# EAGLE board arm_board (EAGLE 8.1.0)
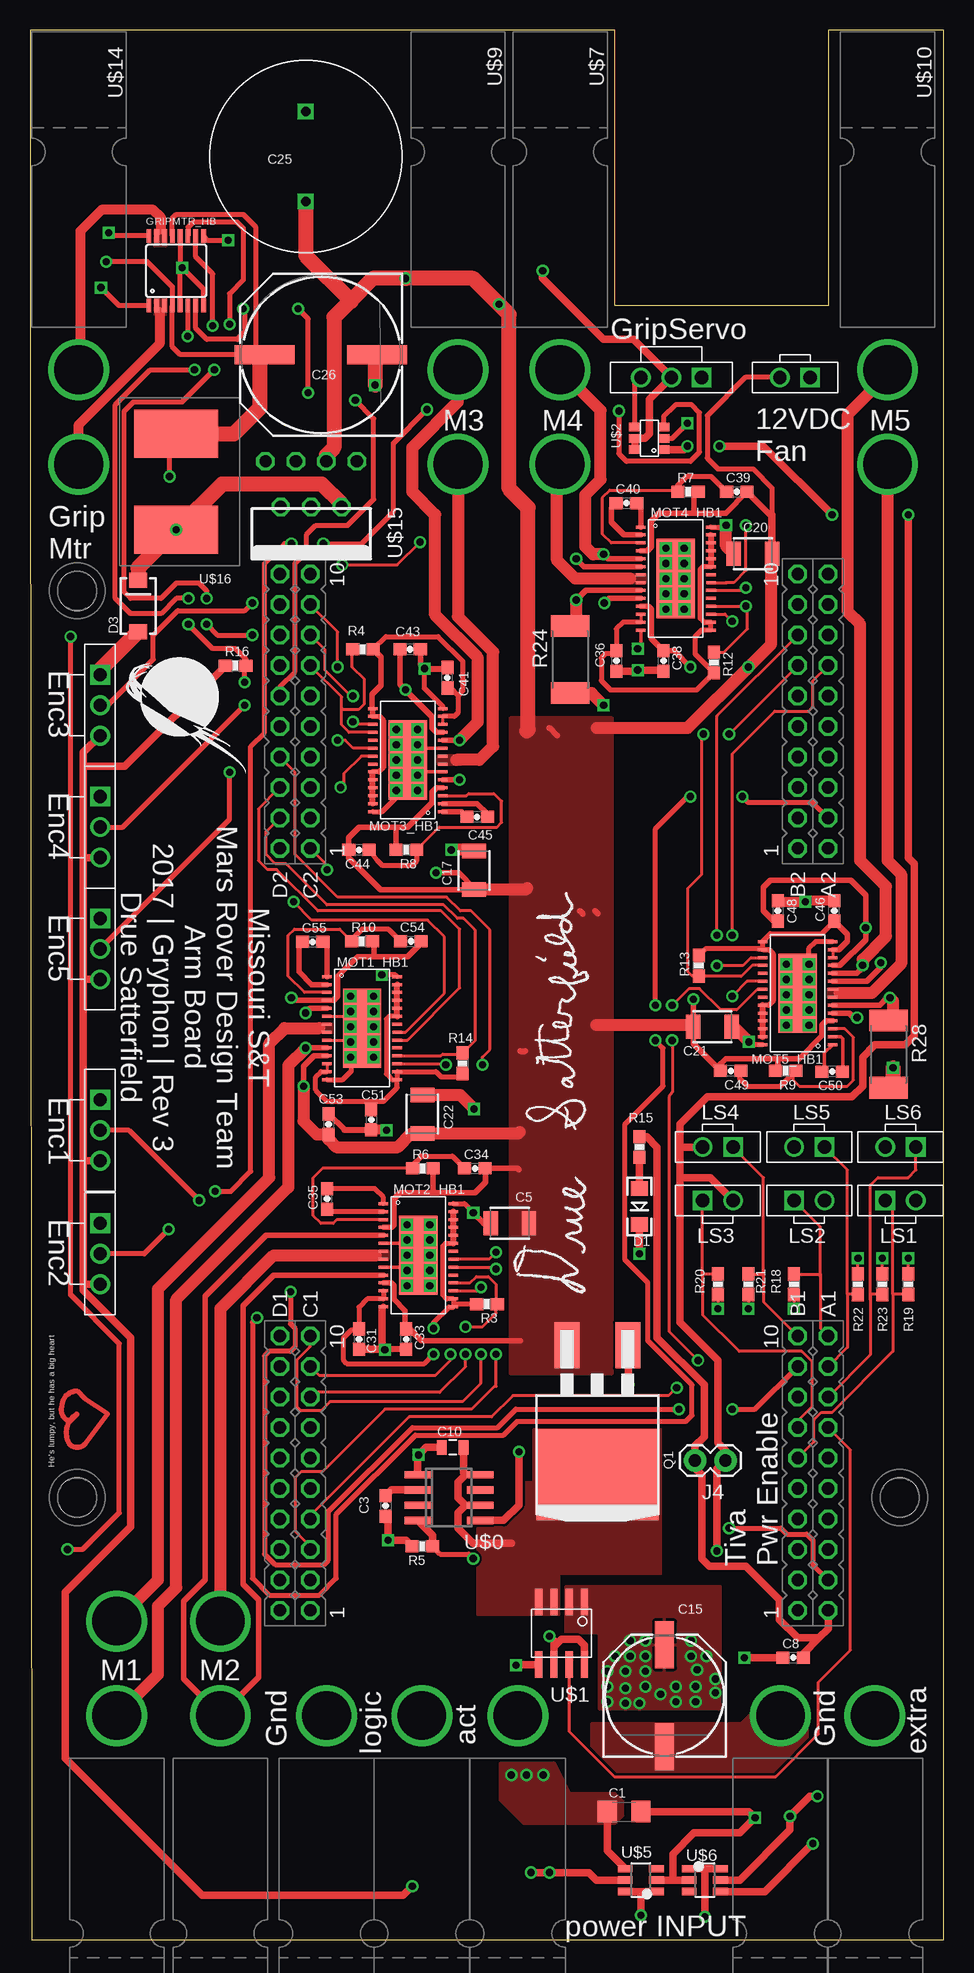
[diagram p4: board, top side]
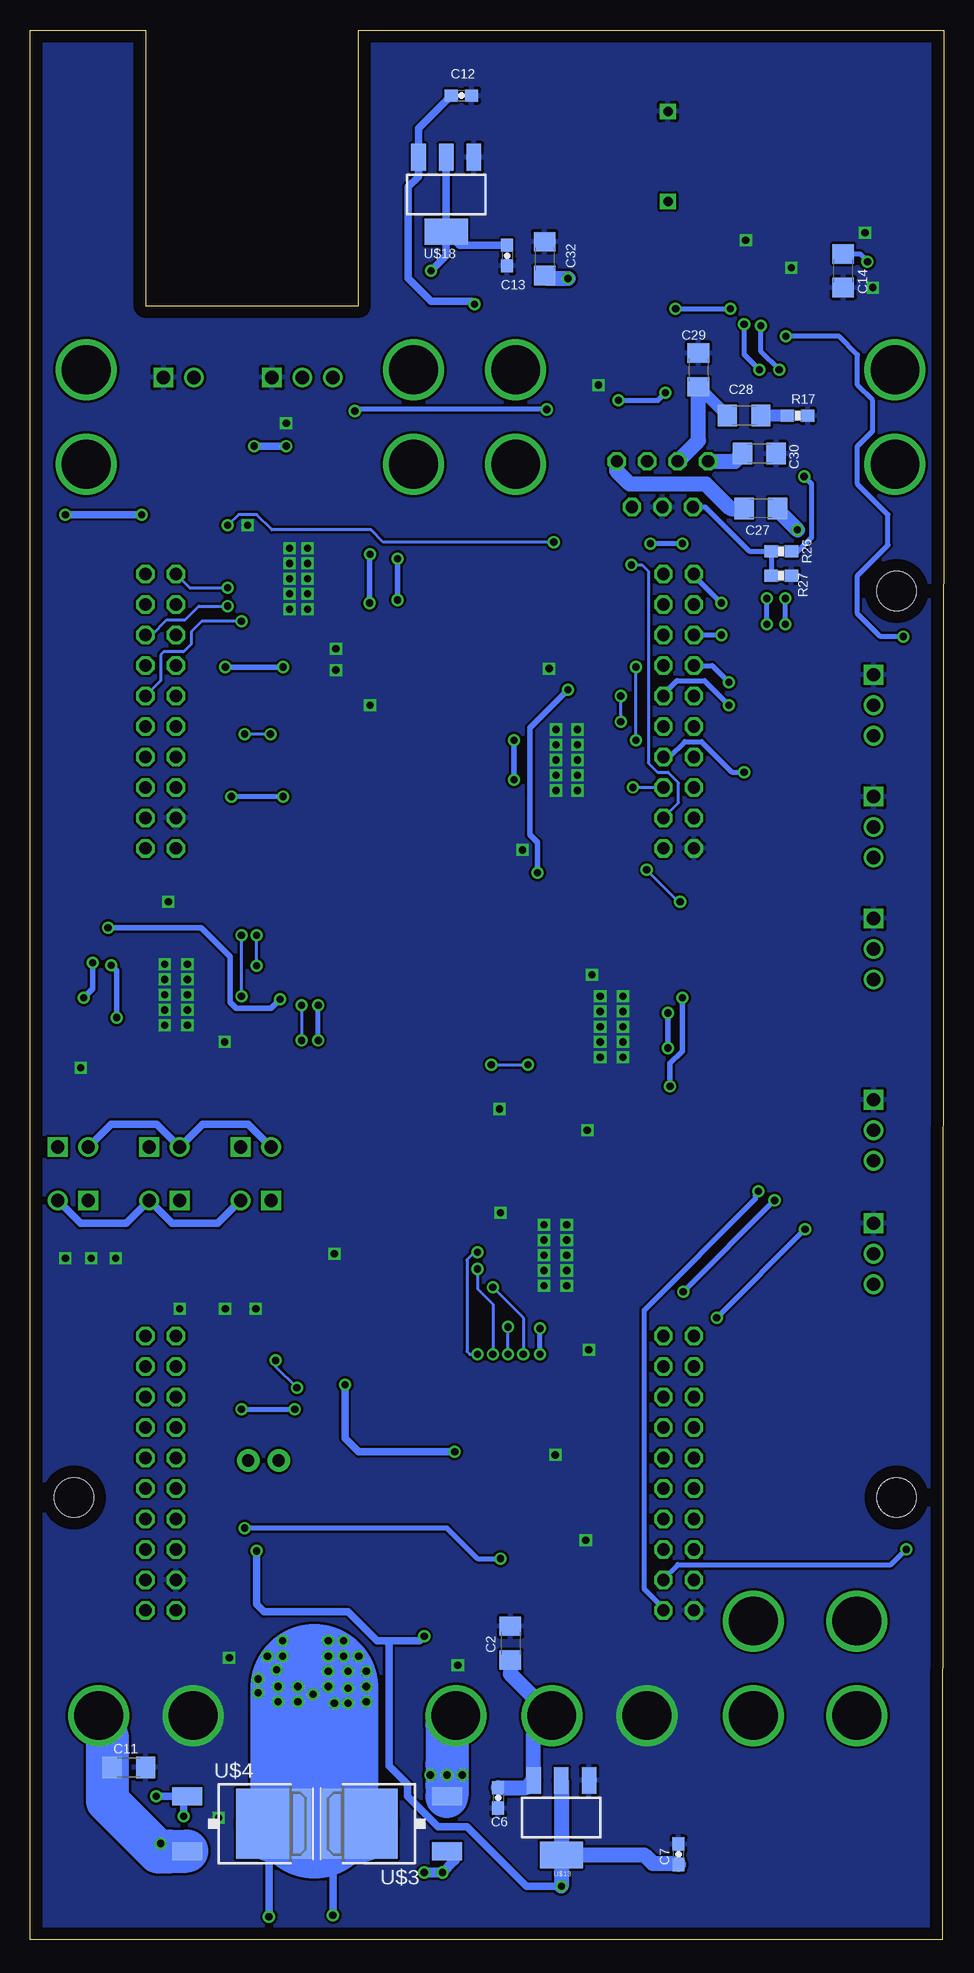
[diagram p5: board, bottom side, seen from below]

Size 76.18 x 159.13 mm. Coordinates in mm from the lower left corner, seen from the top.
Outline: 0.13,0 76.18,0 76.18,159.13 66.55,159.13 66.55,136.14 48.77,136.14 48.77,159.13 0,159.13 0,135.56 0.13,0
Copper layers (1*16): Top 0.035mm / dielectric 1.5mm / Bottom 0.035mm
Design rules "advanced_circuits_standard *": minimum track width 5mil, minimum drill 10mil, track to track 8mil, track to pad 8mil, pad to pad 8mil, via to via 8mil, smd to smd 8mil, copper to edge 40mil, drill to drill 5mil, minimum pad ring 10mil, minimum via ring 8mil, stop-mask expansion 4mil, vias tented up to drill 0mil, thermal gap 10mil

## Footprints (pad centres in the part's own frame; a part is rotated, then mirrored left to right if it is on the bottom)
1206 = smd 1.6 x 1.8: 1 -1.4,0; 2 1.4,0
0603-CAP = smd 1.1 x 1: 1 -0.85,0; 2 0.85,0
1210 = smd 1.2 x 2: 1 -1.6,0; 2 1.6,0
0805 = smd 0.8 x 1.2: 1 -0.9,0; 2 0.9,0
PANASONIC_G = smd 3.9 x 1.6: + 4.25,0; - -4.25,0
C_16MM = drill 0.8 square: + 0,3.75; GND 0,-3.75
PANASONIC_H13 = smd 5 x 1.6: + 4.7,0; - -4.7,0
LED-1206 = smd 1.2 x 1.4: A -1.5,0; C 1.5,0
SMA-DIODE = smd 1.27 x 1.47: A -2.15,0; C 2.15,0
TSSOP-16 = smd 0.4 x 1.1: 1 -2.275,-2.9; 2 -1.625,-2.9; 3 -0.975,-2.9; 4 -0.325,-2.9; 5 0.325,-2.9; 6 0.975,-2.9; 7 1.625,-2.9; 8 2.275,-2.9; 9 2.275,2.9; 10 1.625,2.9; 11 0.975,2.9; 12 0.325,2.9; 13 -0.325,2.9; 14 -0.975,2.9; 15 -1.625,2.9; 16 -2.275,2.9
#4_SCREW = hole 3.264: 0,0
APP45_PCB_HORIZ_RIGHT = drill 4.064: P$1 28.194,3.969
1X02 = drill 1.016 pad 1.88: 1 0,0; 2 2.54,0
MOLEX-70543-0002 = drill 1.1 square: 1 2.54,0 | drill 1.1: 2 0,0; 3 -2.54,0
MOLEX-70543-0001 = drill 1.1 square: 1 1.27,0 | drill 1.1: 2 -1.27,0
TSSOP28-GROUNDPAD = smd 0.8 x 0.25: 1 -2.921,4.298; 2 -2.921,3.637; 3 -2.921,2.977; 4 -2.921,2.317; 5 -2.921,1.656; 6 -2.921,0.996; 7 -2.921,0.335; 8 -2.927,-0.325; 9 -2.921,-0.985; 10 -2.921,-1.646; 11 -2.921,-2.306; 12 -2.921,-2.967; 13 -2.921,-3.627; 14 -2.921,-4.287; 15 2.921,-4.287; 16 2.921,-3.627; 17 2.921,-2.967; 18 2.921,-2.306; 19 2.921,-1.646; 20 2.921,-0.985; 21 2.927,-0.325; 22 2.921,0.335; 23 2.921,0.996; 24 2.921,1.656; 25 2.921,2.317; 26 2.921,2.977; 27 2.921,3.637; 28 2.921,4.298 | smd 3.2 x 6.6: 29 0,0.005
D2PACK = smd 2.083 x 3.81: 1 2.54,-4.191; 2 7.62,-4.191 | smd 10.16 x 7.62: TAB 5.08,6.604
0603-RES = smd 1.1 x 1: 1 -0.85,0; 2 0.85,0
0603-RES@1 = smd 1.1 x 1: 1 -0.85,0; 2 0.85,0
R2512 = smd 1.8 x 3.2: 1 -2.8,0; 2 2.8,0
TIVA-C-CONNECTED = drill 1.016 octagon: +3V3_1 59.69,54.61; +3V3_2 123.19,54.61; +5V_1 59.69,52.07; +5V_2 123.19,52.07; GND_1 57.15,52.07; GND_2 59.69,8.89; GND_3 120.65,52.07; GND_4 123.19,8.89; PA4 39.37,52.07; PA5 36.83,52.07; PA6 105.41,52.07; PA7 52.07,8.89; PB2 102.87,54.61; PB3 100.33,54.61; PB4 54.61,52.07; PB5 52.07,52.07; PC4 118.11,54.61; PC5 115.57,54.61; PC6 113.03,54.61; PC7 105.41,54.61; PD0 107.95,8.89; PD1 110.49,8.89; PD2 57.15,54.61; PD3 107.95,54.61; PD4 49.53,54.61; PD5 46.99,54.61; PD7 107.95,52.07; PE0 118.11,52.07; PE1 115.57,52.07; PE2 113.03,52.07; PE3 110.49,52.07; PE4 120.65,54.61; PE5 110.49,54.61; PF1 123.19,11.43; PF2 120.65,11.43; PF3 118.11,11.43; PG0 115.57,11.43; PG1 59.69,11.43; PH0 44.45,11.43; PH1 41.91,11.43; PH2 118.11,8.89; PH3 115.57,8.89; PK0 49.53,52.07; PK1 46.99,52.07; PK2 44.45,52.07; PK3 41.91,52.07; PK4 57.15,11.43; PK5 54.61,11.43; PK6 39.37,11.43; PK7 36.83,11.43; PL0 107.95,11.43; PL1 105.41,11.43; PL2 102.87,11.43; PL3 100.33,11.43; PL4 113.03,11.43; PL5 110.49,11.43; PM0 52.07,11.43; PM1 49.53,11.43; PM2 46.99,11.43; PM3 120.65,8.89; PM4 102.87,52.07; PM5 100.33,52.07; PM6 36.83,8.89; PM7 57.15,8.89; PN2 105.41,8.89; PN3 102.87,8.89; PN4 36.83,54.61; PN5 39.37,54.61; PP0 54.61,54.61; PP1 52.07,54.61; PP2 100.33,8.89; PP3 41.91,8.89; PP4 41.91,54.61; PP5 54.61,8.89; PQ0 44.45,54.61; PQ1 39.37,8.89; PQ2/PA3 46.99,8.89; PQ3/PA2 44.45,8.89; RST1 49.53,8.89; RST_2 113.03,8.89
SO8 = smd 0.6 x 2.2: 1 -1.905,-2.6; 2 -0.635,-2.6; 3 0.635,-2.6; 4 1.905,-2.6; 5 1.905,2.6; 6 0.635,2.6; 7 -0.635,2.6; 8 -1.905,2.6
SOIC8 = smd 2.2 x 0.6: 1 -2.6,1.905; 2 -2.6,0.635; 3 -2.6,-0.635; 4 -2.6,-1.905; 5 2.6,-1.905; 6 2.6,-0.635; 7 2.6,0.635; 8 2.6,1.905
TSOP-6 = smd 0.991 x 0.711: 1 -1.194,0.94; 2 -1.194,0; 3 -1.194,-0.94; 4 1.194,-0.94; 5 1.194,0; 6 1.194,0.94
TO252 = smd 1.5 x 2.5: 1 -2.28,-4.8; 2 2.28,-4.8 | smd 5.8 x 6.4: 3 0,2.5
TSOT23-6 = smd 0.62 x 1.22: 1 -0.95,-1.3; 2 0,-1.3; 3 0.95,-1.3; 4 0.95,1.3; 5 0,1.3; 6 -0.95,1.3
APP45_HORIZ_CONFIG = drill 4.064: C1 28.194,3.937; C2 36.068,3.937
SOT223 = smd 1.219 x 2.235: 1 -2.311,-3.099; 2 0,-3.099; 3 2.311,-3.099 | smd 3.6 x 2.2: 4 0,3.099
TO-220-7 = drill 1.016 octagon: 1 -3.81,3.81; 2 0,2.54; 3 -3.81,1.27; 4 0,0; 5 -3.81,-1.27; 6 0,-2.54; 7 -3.81,-3.81
.5*.5_SMD = smd 4 x 7: P$1 0,1.27; P$2 8,1.27

## Placement (x,y rotation side)
C1  2.2uF  [1206]  49.53,10.67 0 top
C2  2.2uF  [1206]  36.13,24.7 270 bottom
C3  1.0uF  [0603-CAP]  29.65,36.13 270 top
C5  100uF  [1210]  40.01,59.69 0 top
C6  1.0uF  [0603-CAP]  37.15,11.81 270 bottom
C7  1uF  [0603-CAP]  22.1,7.11 90 bottom
C8  0.01uF  [0603-CAP]  63.63,23.5 0 top
C10  10uF  [0805]  35.24,41.02 180 top
C11  2.2uF  [1206]  67.94,14.35 0 bottom
C12  1.0uF  [0603-CAP]  40.21,153.67 0 bottom
C13  1uF  [0603-CAP]  36.4,140.34 270 bottom
C14  4.7uF  [1206]  8.38,139.06 90 bottom
C15  680uF  [PANASONIC_G]  52.91,20.32 90 top
C17  100uF  [1210]  37.03,89.1 270 top
C20  100uF  [1210]  60.27,115.49 0 top
C21  100uF  [1210]  56.9,76.07 180 top
C22  100uF  [1210]  32.72,68.78 270 top
C25  2200uF  [C_16MM]  22.99,148.59 180 top
C26  470uF  [PANASONIC_H13]  24.26,132.08 180 top
C27  .22uF  [1206]  15.24,119.25 180 bottom
C28  1200pF  [1206]  16.64,127 180 bottom
C29  680pF  [1206]  20.45,130.81 270 bottom
C30  4.7uF  [1206]  15.37,123.83 180 bottom
C31  .47uF  [0603-CAP]  27.43,50.04 270 top
C32  4.7uF  [1206]  33.27,140.08 270 bottom
C33  .1uF  [0603-CAP]  31.37,50.04 90 top
C34  .1uF  [0603-CAP]  37.08,64.26 0 top
C35  .01uF  [0603-CAP]  24.77,61.72 90 top
C36  .47uF  [0603-CAP]  48.9,106.55 270 top
C38  .1uF  [0603-CAP]  52.83,106.55 90 top
C39  .1uF  [0603-CAP]  58.93,120.65 0 top
C40  .01uF  [0603-CAP]  49.73,119.71 0 top
C41  .47uF  [0603-CAP]  34.8,105.16 90 top
C43  .1uF  [0603-CAP]  31.7,107.52 180 top
C44  .1uF  [0603-CAP]  27.43,90.81 180 top
C45  .01uF  [0603-CAP]  37.29,93.55 180 top
C46  .47uF  [0603-CAP]  67.06,85.72 90 top
C48  .1uF  [0603-CAP]  62.36,85.72 270 top
C49  .1uF  [0603-CAP]  58.42,72.39 180 top
C50  .01uF  [0603-CAP]  66.88,72.34 180 top
C51  .47uF  [0603-CAP]  28.45,68.33 270 top
C53  .1uF  [0603-CAP]  24.89,67.94 270 top
C54  .1uF  [0603-CAP]  31.75,83.19 0 top
C55  .01uF  [0603-CAP]  23.57,83.13 0 top
D1  Yellow  [LED-1206]  50.8,61.09 270 top
D3  DIODE-SCHOTTKY_  [SMA-DIODE]  9.02,111.12 90 top
GRIPMTR_HB  MAX14871  [TSSOP-16]  12.19,139.06 0 top
H1  MOUNTING_HOLE#4  [#4_SCREW]  3.94,112.39 0 top
H2  MOUNTING_HOLE#4  [#4_SCREW]  3.94,36.83 0 top
H4  MOUNTING_HOLE#4  [#4_SCREW]  72.52,36.83 0 top
J1  APPPP45_PCB_HORIZ_RIGHT  [APP45_PCB_HORIZ_RIGHT]  28.7,-9.53 90 top
J2  APPPP45_PCB_HORIZ_RIGHT  [APP45_PCB_HORIZ_RIGHT]  36.64,-9.53 90 top
J3  APPPP45_PCB_HORIZ_RIGHT  [APP45_PCB_HORIZ_RIGHT]  44.64,-9.53 90 top
J4  [1X02]  55.45,39.93 0 top
J5  SERVOMOLEX_SL_VERT_TH  [MOLEX-70543-0002]  53.47,130.18 0 top
J6  SL02  [MOLEX-70543-0001]  63.78,130.18 0 top
J17  APPPP45_PCB_HORIZ_RIGHT  [APP45_PCB_HORIZ_RIGHT]  66.55,-9.53 90 top
J18  APPPP45_PCB_HORIZ_RIGHT  [APP45_PCB_HORIZ_RIGHT]  74.42,-9.53 90 top
J19  ENCODER  [MOLEX-70543-0002]  5.84,67.44 90 top
J20  ENCODER  [MOLEX-70543-0002]  5.84,102.87 90 top
J21  ENCODER  [MOLEX-70543-0002]  5.84,92.71 90 top
J22  ENCODER  [MOLEX-70543-0002]  5.84,82.55 90 top
J24  ENCODER  [MOLEX-70543-0002]  5.84,57.15 90 top
LOGO1  MRDT_LOGO  [MRDT_LOGO]  7.19,106.86 270 top
LS1  SL02  [MOLEX-70543-0001]  72.59,61.59 180 top
LS2  SL02  [MOLEX-70543-0001]  64.97,61.59 180 top
LS3  SL02  [MOLEX-70543-0001]  57.35,61.59 180 top
LS4  SL02  [MOLEX-70543-0001]  57.35,66.04 0 top
LS5  SL02  [MOLEX-70543-0001]  64.97,66.04 0 top
LS6  SL02  [MOLEX-70543-0001]  72.59,66.04 0 top
MOT1_HB1  DRV8829  [TSSOP28-GROUNDPAD]  27.69,75.95 0 top
MOT2_HB1  DRV8829  [TSSOP28-GROUNDPAD]  32.39,57.02 0 top
MOT3_HB1  DRV8829  [TSSOP28-GROUNDPAD]  31.5,98.3 180 top
MOT4_HB1  DRV8829  [TSSOP28-GROUNDPAD]  53.85,113.41 0 top
MOT5_HB1  DRV8829  [TSSOP28-GROUNDPAD]  64.01,78.87 180 top
Q1  Q_IRF7437SMD  [D2PACK]  52.39,45.34 180 top
R3  10k  [0603-RES]  38.1,52.96 180 top
R4  10k  [0603-RES]  27.76,107.52 0 top
R5  10k  [0603-RES]  32.7,32.77 180 top
R6  1M  [0603-RES]  32.77,64.26 0 top
R7  1M  [0603-RES]  54.86,120.65 0 top
R8  1M  [0603-RES]  31.37,90.81 180 top
R9  1M  [0603-RES]  62.99,72.39 180 top
R10  1M  [0603-RES]  27.69,83.19 0 top
R12  10k  [0603-RES]  57.02,106.43 270 top
R13  10k  [0603-RES]  55.75,81.15 90 top
R14  10k  [0603-RES]  36.07,73.03 270 top
R15  330  [0603-RES@1]  50.8,66.04 270 top
R16  10k  [0603-RES]  17.14,106.17 0 top
R17  5100 ohm  [0603-RES]  12.19,127 180 bottom
R18  10k  [0603-RES]  63.7,54.61 270 top
R19  10k  [0603-RES]  73.23,54.61 90 top
R20  10k  [0603-RES]  57.35,54.61 270 top
R21  10k  [0603-RES]  59.89,54.61 270 top
R22  10k  [0603-RES]  69.04,54.61 90 top
R23  10k  [0603-RES]  71.07,54.61 90 top
R24  .22  [R2512]  45.03,106.68 270 top
R26  12k  [0603-RES]  13.54,115.7 180 bottom
R27  2k  [0603-RES]  13.54,113.67 0 bottom
R28  .22  [R2512]  71.58,73.79 270 top
U1  TIVA-1294  [TIVA-C-CONNECTED]  11.94,150.62 270 top
U$0  LT1910  [SO8]  34.93,36.83 270 top
U$1  ACS722LLCTR-40AU  [SOIC8]  44.32,25.53 270 top
U$2  74LVC1T45  [TSOP-6]  51.64,125.09 180 top
U$3  SUD15N15  [TO252]  46.23,9.65 90 bottom
U$4  SUD15N15  [TO252]  58.29,9.65 270 bottom
U$5  LM5050  [TSOT23-6]  50.93,4.95 90 top
U$6  LM5050  [TSOT23-6]  56.26,4.95 270 top
U$7  APP45_HORIZ  [APP45_HORIZ_CONFIG]  40.26,159 270 top
U$8  APP45_HORIZ  [APP45_HORIZ_CONFIG]  19.81,-9.53 90 top
U$9  APP45_HORIZ  [APP45_HORIZ_CONFIG]  31.75,159 270 top
U$10  APP45_HORIZ  [APP45_HORIZ_CONFIG]  67.56,159 270 top
U$11  APP45_HORIZ  [APP45_HORIZ_CONFIG]  11.18,-9.53 90 top
U$13  AZ1117EAZ1117EH-3.3  [SOT223]  31.88,10.16 180 bottom
U$14  APP45_HORIZ  [APP45_HORIZ_CONFIG]  0.13,159 270 top
U$15  SI-8010Y  [TO-220-7]  23.44,119.38 270 top
U$16  56UH  [.5*.5_SMD]  13.46,117.47 90 top
U$17  SIG  [SIG]  45.29,65.41 90 top
U$18  AZ1117EAZ1117EH-5.0  [SOT223]  41.48,145.41 180 bottom

## Tracks (layer width: path | path; a pad name or v marks a point on that pad's centre or on a via)
5VSERVO_PWR  (via drill 0.6)
  Top 0.61: U$2.6 U$2.5 51.26,125.09 51.64,125.48 51.64,128.35 J5.2 50.29,133.35 47.83,133.35 42.75,138.43 v42.75,139.06
  Bottom 0.61: U$18.2 U$18.4 | C13.1 40.35,141.19 U$18.4 | U$18.4 41.48,140.34 v42.75,139.06
7VMTR_PWR  (via drill 0.6)
  Top 0.406: GRIPMTR_HB.13 11.87,143.44 12.19,143.76 17.78,143.76 18.8,142.75 18.8,132.21 C26.+ 12.52,132.08 11.87,132.74 GRIPMTR_HB.4 11.87,137.74 9.78,139.83 v6.35,139.83 | v11.63,121.92 11.63,124.92 U$16.P$2
  Top 0.61: 19.81,132.08 C26.+
  Top 1.27: 18.92,132.08 C26.+ 19.18,131.82 19.18,127.64 17.02,125.47 13.46,125.47 | U$16.P$2 13.46,125.47 | 13.46,125.09 13.46,125.47
  Bottom 0.406: C14.2 6.99,140.47 v6.35,139.83 | R26.1 12.27,115.57 11,116.84 11,121.28 v11.63,121.92
12VMTR_PWR  (via drill 0.6)
  Top 0.406: J6.2 59.64,130.18 56.46,127 56.46,123.44 57.35,122.56 60.27,122.56 61.87,120.95 61.87,118.75 61.87,118.55
  Top 0.457: 28.7,81.92 27.31,81.92 25.65,80.26 25.65,78.61 25.3,78.26 MOT1_HB1.4 22.02,78.26 v21.79,78.49 | 28.7,81.92 31.5,81.92 32.6,83.02 | 28.7,83.02 28.7,81.92 | 24.68,67.31 C53.2 | MOT2_HB1.4 30.13,59.34 30.35,59.56 30.35,61.72 30.86,62.23 33.78,62.23 | 33.78,62.23 37.08,62.23 37.97,63.12 37.97,64.22 C34.2 40.64,64.26 40.77,64.14 | R6.2 33.62,62.4 33.78,62.23 | C33.2 31.66,50.89 32.64,49.91 40.89,49.91 | 31.28,50.89 31.28,52.41 30.35,53.34 30.35,54.48 30.12,54.72 MOT2_HB1.11 | 62.36,73.41 58,73.41 57.28,72.68 C49.2 55.32,74.64 55.32,76.1 | 62.36,73.41 64.14,73.41 66.04,75.31 66.04,76.2 66.39,76.55 MOT5_HB1.4 | 62.36,72.39 62.36,73.41 | 47.37,85.47 47.12,85.72 | MOT4_HB1.4 51.47,115.73 51.82,116.08 51.82,118.24 52.45,118.87 55.37,118.87 | 55.37,118.87 58,118.87 C39.2 61.87,118.55 | R7.2 55.37,120.31 55.37,118.87 | MOT4_HB1.11 51.58,111.11 51.82,110.87 51.82,108.42 C38.2 53.71,107.4 v55.07,106.05 | MOT3_HB1.4 33.88,95.98 33.53,95.63 33.53,94.74 31.5,92.71 30.61,92.71 | 30.61,92.71 27.43,92.71 26.54,91.82 26.54,90.84 | 26.54,90.84 C44.2 | R8.2 30.52,92.62 30.61,92.71 | 26.54,90.84 26.54,90.17 29.21,87.5 36.27,87.5 | MOT3_HB1.11 33.89,100.6 33.53,100.97 33.53,101.89 31.32,104.1 v31.32,104.14 30.85,104.61 C43.2 | MOT5_HB1.11 67.53,81.17 69.67,83.31 v69.67,84.33 69.67,87.05 68.45,88.27 61.72,88.27 61.16,87.71 61.16,85.72 62.01,84.88 C48.2 | C17.2 36.65,87.88 36.27,87.5 | 36.27,87.5 36.91,87.5 37.03,87.63 35.76,88.9 v33.86,88.9 | MOT1_HB1.11 23.68,73.64 22.81,72.77 v22.81,71.12 | C21.2 55.32,76.1 | 55.32,76.1 v55.32,78.36
  Top 0.508: 32.6,83.02 C54.2 | 46.1,85.47 45.85,85.72 | R10.2 28.7,83.02 | R9.2 62.36,72.39 | 43.94,100.33 43.31,100.97 | 40.89,74.04 41.28,74.04 | C33.2 31.28,50.89 | C48.2 62.23,85
  Top 0.61: C20.2 61.87,118.75
  Top 1.016: 41.48,87.63 41.35,87.5 C17.2 | v22.81,71.12 22.81,68.2 23.91,67.09 C53.2 24.89,66.67 25.53,66.04 30.68,66.04 31.83,67.18 C22.2 40.72,67.18 40.84,67.31 | 47.24,100.97 54.81,100.97 v59.89,106.05 61.8,107.95 61.8,115.42 C20.2 | C21.2 55.17,76.2 47.19,76.2
  Top 1.27: 41.4,100.71 41.53,100.84 41.53,119.33 39.95,120.9 39.95,135.43 v39.12,136.27 36.96,138.43 v31.32,138.43 28.58,138.43 26.67,136.53 | C25.+ 22.99,140.34 26.8,136.53 26.67,136.53 | 26.67,136.53 25.35,135.2 25.35,124.33 24.71,123.7 U$15.3
  Bottom 0.457: v31.32,104.14 34.49,100.97 34.49,92.08 33.86,91.44 v33.86,88.9 | v22.81,71.12 22.81,73.03 21.79,74.04 v21.79,78.49 | v55.07,106.05 v59.89,106.05 | v55.32,78.36 56.08,77.6 59,77.6 59.51,78.11 59.51,81.92 61.93,84.33 v69.67,84.33
  Bottom 0.61: C12.1 43.79,150.94 U$18.3 43.79,146.91 44.65,146.05 44.65,138.43 42.75,136.53 39.37,136.53 v39.12,136.27 38.94,136.45
  Bottom 1.27: C32.2 33.02,138.43 v31.32,138.43
  pour Top (no thermals): 48.51,47.12 40.08,47.12 40.08,101.85 48.51,101.85
$N3
  Top 0.61: U$0.8 36.32,38.73 | 36.32,38.73 35.69,38.1 35.69,36.83 36.32,36.2 | 36.32,36.2 U$0.6 | C10.1 36.14,38.91 36.32,38.73 | 36.32,36.2 35.69,35.56 35.69,34.29 36.96,33.02 40.13,33.02
  pour Top (rank 2, no thermals): 44.07,27.05 37.34,27.05 37.34,34.29 40.84,38.1 42.04,38.1 42.04,42.55 52.58,42.55 52.58,30.48 44.07,30.48
ACT_PWR_UNGUARDED  (via drill 0.6)
  Top 0.305: 41.43,13.97 41.4,13.94 v41.4,13.72
  Top 0.61: U$5.4 48.13,7.4 C1.1
  Bottom 0.254: 41.43,12.85 41.4,13.34
  Bottom 0.305: 41.4,13.34 v41.4,13.72 41.4,14.58 41.43,14.61
  Bottom 0.61: U$3.2 41.43,11.33 41.4,11.3
  Bottom 3.6: U$3.2 41.43,12.85 41.43,14.61 41.43,17.91 J3.P$1
  other vias: 42.8,13.72 40.13,13.72
  pour Top (no thermals): 39.24,14.73 43.69,14.73 44.96,12.19 48.77,12.19 49.4,11.56 49.4,10.29 48.77,9.65 41.15,9.65 39.24,11.56
CURRENT_INPUT
  Top 0.254: U$1.7 44.96,17.35 48.72,13.59 62.18,13.59 65.74,17.14 65.74,21.46 68.4,24.13 68.4,40.82 U1.PD3
DUAL_PWR  (via drill 0.6)
  Top 0.61: 56.26,5.9 U$6.6 | U$5.6 50.93,4 | U$5.1 50.93,4 | 50.93,4 v50.93,2.03 | U$6.1 56.26,5.9 | 56.26,5.9 v56.26,1.91
  Bottom 0.61: 53.85,9.14 54.48,10.29 U$4.3 55.79,7.37 56.26,7.37 v56.26,1.91 | 51.31,9.14 51.31,9.65 | 52.45,10.41 52.07,10.41 51.31,9.14 | v50.93,2.03 50.93,6.6 51.31,6.6 51.31,9.14 | 52.2,17.78 52.58,18.16 52.58,21.08 v50.8,19.68
  Bottom 10: 52.45,20.95 52.58,21.08
  Bottom 10.668: 52.45,10.41 52.45,20.95
  Bottom 6.452: U$3.3 51.31,9.65 U$4.3
  other vias: 49.66,22.35 55.63,22.48 51.31,23.62 51.31,24.89 50.04,24.89 51.31,22.35 55.12,24.89 55.12,23.62 51.31,21.08 50.04,23.62 52.58,20.45 57.15,20.57 56.39,23.62 48.77,23.62 49.66,20.95 49.66,19.68 48.13,19.81 48.13,21.08 55.5,21.08 53.85,21.08 48.13,22.35 55.5,19.81 53.85,19.81 57.15,21.72
  pour Top: 57.53,19.18 47.5,19.18 47.5,29.46 57.53,29.46
  pour Top (no thermals): 47.5,25.27 47.5,25.53 44.7,25.53 44.7,29.46 49.28,29.46 49.28,25.27
ENC1_PWM_OUT  (via drill 0.6)
  Top 0.406: v14.1,61.59 8.26,67.44 J19.2 | v21.72,53.98 21.72,51.31 22.1,50.93 22.1,49.4 21.72,49.02 19.94,49.02 19.56,48.64 19.56,32.13 20.45,31.24 24.51,31.24 24.89,31.62 24.89,35.69 31.88,42.67 38.99,42.67 40.51,44.2 v54.1,44.2 | v58.55,44.2 60.45,44.2 U1.PM4
  Bottom 0.406: v14.1,61.59 v21.72,53.98 | v58.55,44.2 v54.1,44.2
ENC2_PWM_OUT  (via drill 0.6)
  Top 0.406: v11.56,59.18 9.53,57.15 J24.2 | U1.PD2 65.28,94.74 59.89,94.74 v59.39,95.25 | v55.07,95.25 54.81,95.25 52.15,92.58 v52.15,77.85 | v18.92,51.82 18.54,51.44 18.54,30.1 19.94,28.7 24.13,28.7 25.53,30.1 25.53,35.43 32.13,42.04 39.5,42.04 40.64,43.18 54.69,43.18 55.19,43.69 55.19,46.23 51.51,49.91 51.51,54.74 49.61,56.64 49.61,67.94 52.78,71.12 52.78,74.3 v52.15,74.93
  Bottom 0.406: v11.56,59.18 v18.92,51.82 | v55.07,95.25 v59.39,95.25 | v52.15,74.93 v52.15,77.85
ENC3_PWM_OUT  (via drill 0.6)
  Top 0.406: J20.2 6.48,102.87 10.29,106.68 10.29,108.71 12.32,110.74 17.91,110.74 v18.54,111.38
  Bottom 0.406: U1.PM6 20.83,113.67 v18.54,111.38
ENC4_PWM_OUT  (via drill 0.6)
  Top 0.406: J21.2 7.75,92.71 v17.91,102.87
  Bottom 0.406: U1.PM2 23.37,103.76 22.23,104.9 19.94,104.9 v17.91,102.87
ENC5_PWM_OUT  (via drill 0.6)
  Top 0.406: J22.2 16.64,93.34 v16.64,97.28
  Bottom 0.406: U1.PM0 22.86,98.55 21.59,99.82 20.19,99.82 17.65,97.28 v16.64,97.28
EXTRA_PWR  (via drill 0.6)
  Top 0.254: v65.28,8.01 v65.28,8
  Top 0.61: U$6.4 61.27,4 v65.28,8.01
  Bottom 0.61: v65.28,8 65.91,8 65.91,8.01
  Bottom 0.813: v65.28,8 65.66,7.62 65.66,7.49
  Bottom 1.778: C11.1 70.36,18.76 J18.P$1
  Bottom 3.6: J18.P$1 69.72,16.86 69.72,11.56 65.66,7.49 65.47,7.31 64.58,7.31 64.51,7.37 U$4.2
GND  (via drill 0.6)
  Top 0.254: MOT1_HB1.6 26.33,76.94 v26.73,77.34 | MOT1_HB1.9 26.58,74.96 v26.73,74.8 | C36.2 49.02,105.83 | R20.2 v57.35,52.58 | R21.2 v59.89,52.58 | R18.2 v63.7,52.58 | R22.2 v69.04,56.77 | R23.2 v71.07,56.77 | R19.2 v73.23,56.77
  Top 0.305: MOT2_HB1.6 31.16,58.02 v31.43,58.29 | MOT2_HB1.9 31.15,56.04 v31.43,55.75 | v31.43,57.02 MOT2_HB1.29 | MOT3_HB1.9 32.61,99.28 v32.32,99.57 | MOT3_HB1.6 32.6,97.3 v32.32,97.03 | v32.32,98.3 MOT3_HB1.29 | 33.56,59.34 v33.34,59.56 | 30.32,95.98 v30.54,95.76 | 54.82,114.41 v54.55,114.68 54.93,114.3 | 62.75,75.89 v63.06,76.2 | 28.95,78.92 v28.64,78.61 | MOT4_HB1.14 50.93,107.82 v50.67,107.57
  Top 0.406: MOT3_HB1.14 34.42,102.74 32.89,104.27 v32.89,105.92 | MOT5_HB1.14 65.5,83.15 64.9,82.55 64.9,81.34 v64.96,81.28 | MOT1_HB1.14 26.07,71.66 26.8,72.39 26.8,73.47 v26.73,73.53 | 40.39,22.99 v40.51,22.86 | MOT1_HB1.28 30.46,80.39 v29.34,80.39 | MOT3_HB1.28 29.36,94 30.54,95.19 v30.54,95.76 | MOT4_HB1.28 57.89,117.71 v58.04,117.86 | MOT5_HB1.28 60.18,74.57 v59.94,74.8 | MOT2_HB1.28 36.22,61.32 v36.96,60.58 | GRIPMTR_HB.12 12.52,139.5 v12.7,139.32 | GRIPMTR_HB.8 14.48,136.18 14.48,137.54 v12.7,139.32 | GRIPMTR_HB.5 12.52,139.14 v12.7,139.32 | v16.51,141.6 14.83,141.6 GRIPMTR_HB.9 | U$2.2 53.54,125.09 v54.81,126.36 | GRIPMTR_HB.1 7.42,136.16 v5.92,137.67 | GRIPMTR_HB.16 6.83,141.97 v6.55,142.24
  Top 0.457: v32.89,105.92 32.55,106.26 C43.1
  Top 0.508: MOT2_HB1.14 29.34,52.61 | v32.89,105.92 34.71,105.92 C41.2 | C5.1 37.85,59.69 v36.96,60.58 | C53.1 26.21,67.48 C51.2 | C33.1 29.63,49.19 | 62.57,86.49 62.48,86.58 C48.1
  Top 0.61: C31.2 29.55,49.19 v29.59,49.15 | 29.63,49.19 v29.59,49.15 | v26.73,76.07 27.56,76.07 MOT1_HB1.29 | U$5.2 53.59,4.95 | 53.59,4.95 U$6.2 | U$1.5 42.4,22.91 40.51,22.91 v40.51,22.86 | 29.34,52.61 29.34,49.4 v29.59,49.15 | v29.72,67.44 29.69,67.44 arc-45 29.59,67.48 | C36.2 50.59,105.7 v50.67,105.79 52.74,105.79 C38.1 | MOT5_HB1.29 63.18,78.86 v63.06,78.74 | MOT4_HB1.29 v54.54,113.42 v54.55,113.41 | U$0.1 32.33,40.33 v32.39,40.39 33.02,41.02 C10.2 | C3.2 29.65,34.96 29.85,34.77 v29.85,33.27 31.34,33.27 R5.2 | 53.59,4.95 53.59,7.11 55.37,8.89 59.18,8.89 v60.45,10.16 59.94,10.67 C1.2 | D1.C v50.8,57.15 | C8.1 v59.56,23.5
  Top 0.813: C46.2 64.73,86.58 v64.64,86.49 62.57,86.49 | 29.59,67.48 C51.2 | v59.56,23.5 59.64,23.5
  Top 1.016: R24.2 46.82,103.88 v47.83,102.87 | C17.1 36.93,90.81 v35.13,90.81 | C22.1 35.87,70.38 v37.03,69.22 | C20.1 58.04,116.13 v58.04,117.86 | C21.1 58.67,76.07 v59.94,74.8
  Top 1.27: D3.A 5.84,105.8 J20.1 | C26.- 28.78,131.9 v28.78,129.54 | v71.96,72.64 71.96,71.37 R28.2
  other vias: 33.34,57.02 33.34,55.75 33.34,54.48 31.43,54.48 30.54,98.3 30.54,99.57 30.54,100.84 32.32,100.84 32.32,95.76 53.02,115.95 53.02,113.41 53.02,110.87 54.55,112.14 54.55,110.87 63.06,80.01 63.06,81.28 64.96,76.2 64.96,78.74 28.64,76.07 28.64,74.8 28.64,73.53 63.06,77.47 33.34,58.29 30.54,97.03 54.55,115.95 28.64,77.34 31.43,59.56 26.73,78.61 64.96,80.01 64.96,77.47 53.02,114.68 53.02,112.14
  pour Bottom: -11.56,158.88 48.39,158.88 48.39,135.89 66.8,135.89 66.8,159.38 83.95,157.86 84.58,-4.7 -12.19,-3.81
  pour Top (no thermals): 46.86,12.95 46.86,18.03 59.31,18.03 61.21,19.94 64.39,19.94 64.77,19.56 64.77,12.95
GRIPMTR_1
  Top 0.813: 10.92,142.49 10.92,143.51 10.29,144.15 5.97,144.15 4.19,142.37 4.19,130.94 U$14.C1
  pour Top (no thermals): 10.41,141.1 10.41,142.49 11.3,142.49 11.3,141.1
GRIPMTR_2
  Top 0.813: U$14.C2 4.06,126.24 10.8,132.97 10.8,135.64
  pour Top (no thermals): 10.41,135.38 10.41,136.78 11.3,136.78 11.3,135.38
GRIPMTR_NENABLE  (via drill 0.6)
  Top 0.406: GRIPMTR_HB.11 13.17,142.71 13.59,143.13 17.27,143.13 17.78,142.62 17.78,138.3 16.64,137.16 v16.64,134.62 | v14.73,109.6 15.62,108.71 v18.54,108.71 | v14.73,111.76 14.73,112.39 14.1,113.03 12.19,113.03 10.92,111.76 8.38,111.76 7.87,112.27 7.87,127.38 8.64,128.14 12.7,128.14 v15.37,130.81
  Bottom 0.406: v14.73,109.6 v14.73,111.76 | v15.37,130.81 16.64,132.08 v16.64,134.62 | v18.54,108.71 U1.PP3
GRIPMTR_NFAULT  (via drill 0.6)
  Top 0.406: v15.24,134.49 15.24,138.81 13.82,140.23 GRIPMTR_HB.10 | v13.21,109.6 15.24,107.57 17.15,107.57 18,106.72 R16.2 17.91,106.08 v17.91,104.78 | v13.21,111.76 12.19,111.76 10.92,110.49 8.38,110.49 7.11,111.76 7.11,127.89 10.03,130.81 v13.72,130.81
  Bottom 0.406: v13.21,109.6 v13.21,111.76 | v13.72,130.81 15.24,132.33 v15.24,134.49 | U1.PQ3/PA2 19.3,106.17 v17.91,104.78
GRIPMTR_PHASE  (via drill 0.6)
  Top 0.406: U1.PQ2/PA3 20.83,104.39 22.1,105.66 22.1,114.68 23.06,115.65 23.06,117.09 23.83,117.86 26.49,117.86 28.65,120.02 28.65,126.75 v27.13,128.27 | v17.78,135.89 17.91,135.76 17.91,133.99 17.27,133.35 14.73,133.35 13.82,134.26 GRIPMTR_HB.7 | v23.19,128.91 23.19,135.05 v22.35,135.89
  Bottom 0.406: v22.35,135.89 v17.78,135.89 | v27.13,128.27 23.83,128.27 v23.19,128.91
GRIPMTR_PWM  (via drill 0.6)
  Top 0.406: v3.12,32.51 4.39,32.51 7.44,35.56 7.44,49.66 3.38,53.72 v3.38,108.58 | v13.16,133.6 13.17,133.61 GRIPMTR_HB.6
  Bottom 0.406: U1.PF2 23.37,30.05 22.17,31.24 4.39,31.24 v3.12,32.51 | v13.16,133.6 8.71,133.6 7.19,132.08 7.19,129.54 5.92,128.27 5.92,125.73 7.19,124.46 7.19,121.28 4.65,118.75 4.65,116.2 7.19,113.67 7.19,110.49 5.28,108.58 v3.38,108.58
GRIPSERVO_CTL  (via drill 0.6)
  Top 0.406: U$2.3 52.83,126.92 53.8,127.89 55.19,127.89 55.83,127.25 55.83,123.95 55.07,123.19 49.73,123.19 49.1,123.83 v49.1,127.38 | v15.44,62.36 16.76,62.36 18.42,64.01 18.42,99.44 19.56,100.58 19.56,114.68 21.21,116.33 v21.79,116.33 | v24.46,116.33 27.64,116.33 30.3,119 30.3,124.71 v33.1,127.51
  Bottom 0.406: U1.PF1 23.37,27.61 24.97,29.21 24.97,52.45 15.7,61.72 15.7,62.1 v15.44,62.36 | v21.79,116.33 v24.46,116.33 | v33.1,127.51 48.97,127.51 v49.1,127.38
HB_3.3_OUTPUT5  (via drill 0.6)
  Top 0.254: 34.87,53.4 MOT2_HB1.16
  Top 0.406: MOT2_HB1.15 MOT2_HB1.16 34.74,53.4 34.42,53.72 34.42,57.78 34.67,58.04 35.29,58.04 MOT2_HB1.23 | MOT2_HB1.12 MOT2_HB1.13 28.12,53.4 27.43,52.7 C31.1 27.34,50.8 26.8,50.8 26.16,50.16 26.16,48.26 26.42,48.01 32.89,48.01 v33.66,48.77 | v33.66,50.93 33.66,51.44 34.93,52.7 35.31,52.7 MOT2_HB1.15 | R3.2 35.53,52.96 MOT2_HB1.15
  Top 0.508: MOT2_HB1.23 MOT2_HB1.24 MOT2_HB1.25 MOT2_HB1.26 MOT2_HB1.27
  Bottom 0.406: v33.66,48.77 v33.66,50.93
HB_3.3_OUTPUT6
  Top 0.254: MOT4_HB1.12 MOT4_HB1.13
  Top 0.406: MOT4_HB1.13 49.46,109.78 48.9,109.22 C36.1 48.68,107.19 48.01,107.19 47.63,106.81 47.63,104.9 48.39,104.14 55.59,104.14 R12.2 55.45,107.15 55.45,108.58 55.99,109.12 MOT4_HB1.15 MOT4_HB1.16 | MOT4_HB1.16 56.33,109.78 | MOT4_HB1.23 56.75,114.43 56.13,114.43 55.88,114.17 55.88,110.11 56.21,109.78 MOT4_HB1.16
  Top 0.508: MOT4_HB1.27 MOT4_HB1.26 MOT4_HB1.25 MOT4_HB1.24 MOT4_HB1.23
HB_3.3_OUTPUT7
  Top 0.254: MOT3_HB1.12 MOT3_HB1.13
  Top 0.406: 35.69,103.67 35.69,102.23 35.38,101.92 MOT3_HB1.13 | C41.1 35.05,104.31 35.69,103.67 | 35.69,103.67 36.07,104.05 36.07,106.55 34.04,108.58 29.68,108.58 R4.2 | MOT3_HB1.16 29.14,101.92 29.46,101.6 29.46,97.66 29.1,97.3 MOT3_HB1.23
  Top 0.457: MOT3_HB1.16 MOT3_HB1.15 28.52,102.64 28.52,103.76 29.29,104.52 29.29,106.84 R4.2
  Top 0.508: MOT3_HB1.27 MOT3_HB1.26 MOT3_HB1.25 MOT3_HB1.24 MOT3_HB1.23
HB_3.3_OUTPUT8
  Top 0.254: MOT5_HB1.13 MOT5_HB1.12
  Top 0.406: 67.06,84.84 C46.1 66,83.82 61.72,83.82 61.09,83.19 MOT5_HB1.15 MOT5_HB1.16 | MOT5_HB1.16 61.03,82.55 56.3,82.55 R13.2 | MOT5_HB1.16 61.52,82.49 | MOT5_HB1.23 61.11,77.85 61.6,77.85 61.98,78.23 61.98,82.17 61.65,82.49 MOT5_HB1.16
  Top 0.457: MOT5_HB1.13 67.46,82.49 68.15,83.19 68.15,83.78 C46.1
  Top 0.508: MOT5_HB1.27 MOT5_HB1.26 MOT5_HB1.25 MOT5_HB1.24 MOT5_HB1.23
HB_3.3_OUTPUT9
  Top 0.254: MOT1_HB1.12 MOT1_HB1.13
  Top 0.406: MOT1_HB1.15 MOT1_HB1.16 33.85,72.32 34.29,71.88 35.78,71.88 R14.2 35.9,72.01 | 28.07,69.85 24.77,69.85 23.83,70.79 23.83,71.88 24.26,72.32 MOT1_HB1.13 | 28.07,69.85 29.46,69.85 30.61,70.99 MOT1_HB1.15 | C51.1 28.45,69.47 28.07,69.85 | MOT1_HB1.23 29.95,76.94 29.72,76.71 29.72,72.14 30.2,71.66 MOT1_HB1.15
  Top 0.508: MOT1_HB1.23 MOT1_HB1.24 MOT1_HB1.25 MOT1_HB1.26 MOT1_HB1.27
LOG_PWR_3.3V  (via drill 0.6)
  Top 0.61: 43.69,24.38 44.32,25.02 45.72,25.02 46.23,24.51 U$1.8 | 43.69,24.38 43.69,24.89 v43.31,25.27 | 4.45,54.61 4.45,54.1 8.38,50.16 8.38,34.42 2.92,28.96 2.92,15.11 14.35,3.68 31.12,3.68 v31.88,4.45 | 4.45,54.61 4.45,64.9 | 4.45,64.9 4.45,80.01 | 4.45,80.01 4.45,90.17 | 4.45,90.17 4.45,97.79 | 4.45,97.79 4.45,98.93 J20.3 | 43.69,24.38 U$1.6 | J22.3 4.45,80.01 | J21.3 4.45,90.17 | J24.3 4.45,54.61 | J19.3 4.45,64.9 | R16.1 7.91,97.79 4.45,97.79 | U$2.1 54.51,124.16 v54.81,124.46 | v57.48,124.46 61.16,124.46 v66.88,118.75 | v73.23,118.75 73.23,90.17 73.74,89.66 73.74,75.31 72.97,74.55 70.43,74.55 69.42,73.53 69.42,71.12 68.53,70.23 56.46,70.23 54.18,67.94 54.18,66.04 | v57.28,32.38 57.28,39.22 J4.2 57.99,40.77 57.35,41.4 57.35,48.26 54.18,51.44 54.18,63.5 | 54.18,63.5 54.18,66.04 | 54.18,66.04 LS4.2 | 54.18,63.5 56.72,63.5 LS3.2
  Bottom 0.61: v57.28,32.38 57.28,27.94 56.64,27.3 49.66,27.3 47.24,24.89 46.48,24.89 | 46.48,24.89 43.69,24.89 v43.31,25.27 43.24,25.34 | 46.48,24.89 46.23,24.64 46.23,14.48 44.7,12.95 44.7,11.94 42.16,9.4 39.75,9.4 34.8,4.45 v31.88,4.45 | v54.81,124.46 v57.48,124.46 | v66.88,118.75 v73.23,118.75 | LS3.2 60.53,59.69 64.34,59.69 LS2.2 68.15,59.69 71.96,59.69 LS1.2 | LS4.2 57.99,67.94 61.8,67.94 LS5.2 65.61,67.94 69.42,67.94 LS6.2
  Bottom 1.27: U$13.2 U$13.4 | U$13.4 24.97,7.06 24.26,6.35 22.19,6.35 C7.1 | U$13.4 v31.88,4.45
LOG_PWR_12V
  Bottom 1.27: C2.2 36.13,22.13 J2.P$1 34.19,17.15 U$13.3 34.79,12.66 C6.1
LS1_SIG
  Top 0.254: LS1.1 71.96,60.96 71.96,53.76 | 71.96,53.76 71.96,49.02 66.88,43.94 65.99,43.94 65.35,43.31 65.35,41.48 U1.PE3 | 73.01,53.98 R19.1 71.96,53.76
LS2_SIG
  Top 0.254: LS2.1 65.91,59.38 65.91,55.24 | U1.PB3 65.91,50.93 65.91,55.24 | R18.1 65.91,55.46 65.91,55.24
LS3_SIG
  Top 0.254: U1.PD7 64.01,43.23 65.23,44.45 65.23,48.13 64.34,49.02 59.13,49.02 56.08,52.07 56.08,55.24 | 56.08,55.24 LS3.1 | R20.1 56.08,55.46 56.08,55.24
LS4_SIG
  Top 0.254: LS4.1 61.16,63.5 61.16,55.24 | U1.PM5 61.16,53.14 61.16,55.24 | R21.1 61.16,55.46 61.16,55.24
LS5_SIG
  Top 0.254: U1.PB2 68.15,49.35 68.15,53.76 | 68.15,53.76 68.15,64.14 LS5.1 | R22.1 68.15,53.76
LS6_SIG
  Top 0.254: LS6.1 73.86,64.14 73.23,63.5 70.69,63.5 70.05,62.87 70.05,53.34 | U1.PC7 70.05,48.72 70.05,53.34 | 70.85,53.98 R23.1 70.05,53.76 70.05,53.34
MAIN_PWR_SWITCH_CTL  (via drill 0.6)
  Top 0.406: U1.PE4 65.28,31.24 65.28,33.27 64.77,33.78 63.12,33.78 62.61,34.29 v58.29,34.29 | R5.1 34.19,32.13 36.58,32.13 v36.96,31.75
  Top 0.61: U$0.4 33.55,33.7 R5.1
  Bottom 0.406: v58.29,34.29 41.4,34.29 38.86,31.75 v36.96,31.75
MOT1_1  (via drill 0.6)
  Top 0.457: MOT1_HB1.10 v22.99,74.3 | v22.99,77.22 23.37,77.6 MOT1_HB1.5
  Top 1.016: U$11.C1 10.67,22.1 10.67,27.81 12.19,29.34 12.19,53.34 21.54,62.69 21.54,72.85 v22.99,74.3
  Bottom 0.457: v22.99,77.22 v22.99,74.3
MOT1_2
  Top 0.254: MOT1_HB1.7
  Top 1.016: 24.13,75.95 21.21,75.95 19.94,74.68 19.94,63.5 10.67,54.23 10.67,29.97 U$11.C2
  pour Top (no thermals): 25.15,75.56 23.24,75.56 23.24,76.33 25.15,76.33
MOT1_NFAULT
  Top 0.254: 35.83,73.64 R14.1 | MOT1_HB1.18 34.27,73.64 34.42,73.79 35.98,73.79 R14.1 | U1.PM7 19.69,92.33 19.69,90.42 20.45,89.66 21.34,89.66 24.77,86.23 34.49,86.23 35.64,85.09 36.14,85.09 37.08,84.15 37.08,74.89 R14.1
MOT1_NSLEEP  (via drill 0.6)
  Top 0.254: v37.72,72.9 37.72,73.53 38.35,74.17 38.35,84.15 36.78,85.72 35.89,85.72 34.75,86.87 25.65,86.87 22.1,90.42 22.1,97.28 U1.PA7 | MOT1_HB1.17 34.59,72.98 v34.67,72.9
  Bottom 0.254: v37.72,72.9 v34.67,72.9
MOT1_PHASE
  Top 0.254: MOT1_HB1.20 31.47,74.96 35.81,79.31 35.81,84.2 34.29,85.72 24,85.72 20.57,89.15 19.81,89.15 19.05,89.92 19.05,94.23 U1.PP5
MOT1_PWM  (via drill 0.6)
  Top 0.254: MOT1_HB1.21 31.3,75.62 34.54,78.87 34.54,83.57 33.15,84.96 23.5,84.96 v21.97,86.49 | v24.77,89.15 24.77,89.53 U1.PG1
  Bottom 0.254: v21.97,86.49 22.1,86.49 v24.77,89.15
MOT2_1
  Top 0.457: MOT2_HB1.5 19.69,58.68 14.61,53.59 14.61,29.97 12.83,28.19 12.83,21.72 U$8.C1 19.05,21.84 19.05,28.32 17.78,29.59 17.78,52.83 20.33,55.38 MOT2_HB1.10
MOT2_2
  Top 1.016: 28.83,57.02 20.32,57.02 15.88,52.58 U$8.C2
  pour Top (no thermals): 29.84,56.64 28.19,56.64 28.19,57.4 29.84,57.4
MOT2_NFAULT  (via drill 0.6)
  Top 0.254: U1.PL1 23.75,45.59 34.16,45.59 36.32,47.75 v36.32,48.77 | v36.32,51.05 37.72,51.05 38.86,52.2 38.86,53.12 R3.1 38.86,53.05 38.86,54.61 38.23,55.24 37.21,55.24 36.68,54.72 MOT2_HB1.18
  Bottom 0.254: v36.32,48.77 v36.32,51.05
MOT2_NSLEEP  (via drill 0.6)
  Top 0.254: U1.PL2 24.13,46.99 33.78,46.99 35.05,48.26 v35.05,48.77 | MOT2_HB1.17 37.29,54.06 v37.59,54.36
  Bottom 0.254: v35.05,48.77 35.05,51.82 v37.59,54.36
MOT2_PHASE  (via drill 0.6)
  Top 0.254: v37.59,48.77 37.59,46.35 36.07,44.83 25.02,44.83 24.26,44.07 22.61,44.07 22.23,44.45 22.23,48.26 23.37,49.4 U1.PL3 | MOT2_HB1.20 38.7,56.04 v38.86,55.88
  Bottom 0.254: v38.86,55.88 38.86,54.23 37.59,52.96 v37.59,48.77
MOT2_PWM  (via drill 0.6)
  Top 0.254: v38.86,48.77 38.86,46.1 38.74,46.1 36.83,44.2 29.59,44.2 24.38,38.99 22.61,38.99 22.1,38.48 22.1,34.04 23.37,32.77 U1.PF3 | MOT2_HB1.21 38.28,56.7 v38.86,57.28
  Bottom 0.254: v38.86,57.28 39.12,57.28 39.75,56.64 39.75,49.02 39.5,48.77 v38.86,48.77
MOT3_1  (via drill 0.6)
  Top 0.457: MOT3_HB1.5 v35.81,96.64 v35.81,96.65 | MOT3_HB1.10 v35.81,99.94 v35.81,99.95
  Top 1.016: v35.81,99.95 37.34,101.47 37.34,106.81 33.78,110.36 33.78,118.75 31.88,120.65 31.88,124.33 35.69,128.14 U$9.C1
  Bottom 0.457: v35.81,96.65 v35.81,99.95
MOT3_2
  Top 1.016: 35.56,98.3 37.47,98.3 38.61,99.44 38.61,107.31 35.69,110.24 U$9.C2
  pour Top (no thermals): 35.94,97.92 34.04,97.92 34.04,98.68 35.94,98.68
MOT3_NFAULT
  Top 0.254: U1.PH0 25.98,103.56 25.98,102.62 | MOT3_HB1.18 26.6,100.6 25.98,101.22 25.98,102.62 | 25.98,102.62 26.11,102.49 27.38,102.49 27.89,103 27.89,105.03 26.87,106.05 26.87,107.48 R4.1
MOT3_NSLEEP  (via drill 0.6)
  Top 0.254: 23.5,108.58 U1.PH1 24.59,107.49 24.59,105.79 26.75,103.63 v26.92,103.63 | MOT3_HB1.17 27.13,101.27 v26.92,101.47
  Bottom 0.254: v26.92,101.47 v26.92,103.63
MOT3_PHASE  (via drill 0.6)
  Top 0.254: MOT3_HB1.20 26.95,99.28 26.29,99.95 v25.65,99.95 | v25.65,106.05 25.65,108.97 U1.PK6
  Bottom 0.254: v25.65,99.95 v25.65,106.05
MOT3_PWM  (via drill 0.6)
  Top 0.254: MOT3_HB1.21 27.63,98.62 26.16,97.16 26.16,96.27 v25.91,96.01
  Bottom 0.254: v25.91,96.01 U1.PK5
MOT4_1  (via drill 0.6)
  Top 0.457: MOT4_HB1.10 48.27,111.77 v47.88,111.38 | MOT4_HB1.5 48.2,115.07 v47.83,115.44
  Top 1.016: v47.83,115.44 46.94,115.44 46.3,116.08 46.3,120.4 47.57,121.67 47.57,127.43 U$7.C1
  Bottom 0.457: v47.88,111.38 47.88,115.39 v47.83,115.44
MOT4_2
  Top 1.016: 50.04,113.41 45.47,113.41 43.94,114.94 43.94,122.68 U$7.C2
  pour Top (no thermals): 51.31,113.03 49.66,113.03 49.66,113.79 51.31,113.79
  pour Top (no thermals): 51.31,113.03 49.66,113.03 49.66,113.79 51.31,113.79
MOT4_NFAULT  (via drill 0.6)
  Top 0.254: MOT4_HB1.18 59.67,111.11 v59.69,111.12 59.82,111 59.82,109.22 57.87,107.28 R12.1
  Bottom 0.254: U1.PP4 66.04,108.71 64.77,109.98 63.25,109.98 62.1,111.12 v59.69,111.12
MOT4_NSLEEP  (via drill 0.6)
  Top 0.254: MOT4_HB1.17 57.96,110.44 v58.55,109.86
  Bottom 0.254: U1.PD5 65.28,104.9 65.28,107.06 65.02,107.31 63.37,107.31 62.74,107.95 62.74,108.97 61.85,109.86 v58.55,109.86
MOT4_PHASE  (via drill 0.6)
  Top 0.254: MOT4_HB1.20 59.47,112.43 v59.69,112.65
  Bottom 0.254: U1.PA5 62.87,112.65 v59.69,112.65
MOT4_PWM  (via drill 0.6)
  Top 0.254: MOT4_HB1.21 57.99,113.09 58.1,113.09 58.68,113.09 59.69,114.1 v59.69,117.86 | v26.04,114.55 30.61,114.55 v32.51,116.46
  Bottom 0.254: U1.PK4 22.1,94.74 22.1,96.39 22.99,97.28 23.88,97.28 24.64,98.04 24.64,114.05 25.15,114.55 v26.04,114.55 | v59.69,117.86 58.8,118.75 57.28,118.75 56.01,117.47 47.75,117.47 46.74,116.46 v32.51,116.46
MOT5_1  (via drill 0.6)
  Top 0.457: MOT5_HB1.5 68.32,77.21 68.7,76.83 v68.96,76.83 | MOT5_HB1.10 68.96,80.51 69.42,80.97 v69.42,81.2
  Top 1.016: U$10.C1 71.5,130.43 68.2,127.13 68.2,110.62 69.22,109.6 69.22,89.92 71.37,87.76 71.37,83.62 69.42,81.66 v69.42,81.2
  Bottom 0.457: v68.96,76.83 68.96,80.75 v69.42,81.2
MOT5_2
  Top 0.254: MOT5_HB1.8
  Top 1.016: U$10.C2 71.5,89.92 72.64,88.77 72.64,81.33 70.18,78.87 67.51,78.87
  pour Top (no thermals): 68.2,78.49 66.55,78.49 66.55,79.25 68.2,79.25
MOT5_NFAULT  (via drill 0.6)
  Top 0.254: v58.29,100.46 U1.PK2 | v56.13,100.46 56.01,100.33 56.01,88.77 54.86,87.63 54.86,80.64 55.21,80.3 R13.1 55.79,80.26 59.31,80.26 60.22,81.17 MOT5_HB1.18
  Bottom 0.254: v56.13,100.46 v58.29,100.46
MOT5_NSLEEP  (via drill 0.6)
  Top 0.254: U1.PK3 57.28,101.98 v57.28,83.69 | MOT5_HB1.17 60.12,81.83 59.44,81.15 v57.28,81.15
  Bottom 0.254: v57.28,81.15 v57.28,83.69
MOT5_PHASE  (via drill 0.6)
  Top 0.254: U1.PQ0 65.28,104.9 65.28,102.74 64.9,102.36 62.1,102.36 58.55,98.81 v58.55,83.69 | MOT5_HB1.20 59.79,79.85 v58.55,78.61
  Bottom 0.254: v58.55,78.61 v58.55,83.69
MOT5_PWM  (via drill 0.6)
  Top 0.254: MOT5_HB1.21 60.65,79.19 58.93,77.47 57.61,77.47 55.83,79.25 54.94,79.25 v53.54,77.85 | U1.PG0 23.37,35.31 31.62,43.56 38.48,43.56 40.26,45.34 53.21,45.34 53.85,45.97 v53.92,45.97 | v53.54,74.93 53.54,70.61 53.29,70.23 53.29,50.67 v55.7,48.26
  Bottom 0.254: v53.92,45.97 55.7,47.75 v55.7,48.26 | v53.54,77.85 v53.54,74.93
N$1
  Top 0.61: U$0.2 30.14,37.47 C3.1
N$2
  Top 0.406: U$2.4 50.44,129.69 J5.3
N$3  (via drill 0.6)
  Top 0.61: 49.66,49.34 Q1.1 49.91,49.47 v49.91,46.23 | v40.77,40.64 40.77,36.2 39.5,34.92 U$0.5
  Bottom 0.61: v40.77,40.64 48.77,40.64 49.91,41.78 v49.91,46.23
N$4
  Top 0.406: 6.48,43.81 4.57,41.27 arc-90 3.3,41.27 arc-90 3.94,43.81 3.3,43.18 arc-90 2.67,44.45 arc-90 3.94,45.72 4.57,45.09 6.48,43.81
N$5  (via drill 0.6)
  Top 0.457: MOT4_HB1.6 46.2,114.41 v45.54,115.06 | 45.54,109.99 R24.1 | MOT4_HB1.9 46.34,112.43 v45.54,111.63
  Top 1.016: 45.54,109.99 v45.54,111.63
  Bottom 0.457: v45.54,115.06 v45.54,111.63
N$6  (via drill 0.6)
  Top 0.254: 66.91,77.85 MOT5_HB1.6
  Top 0.406: 71.58,77.22 R28.1
  Top 0.457: MOT5_HB1.6 70.84,77.87 71.45,78.49 v71.7,78.49 | MOT5_HB1.9 69.77,79.85 70.94,81.03 v70.94,81.41
  Top 1.016: v71.7,78.49 71.96,78.23 71.96,76.83 71.71,76.59 R28.1
  Bottom 0.457: v70.94,81.41 70.94,79.25 v71.7,78.49
N$8  (via drill 0.6)
  Top 0.61: U$5.5 47.24,4.95 46.61,5.59 v43.31,5.59 v41.78,5.59
  Bottom 0.61: 41.78,7.65 U$3.1
  Bottom 0.813: v43.31,5.59 v41.78,5.59 40.77,6.6 40.77,6.99 41.15,7.37 U$3.1
N$9
  Bottom 1.27: U$15.7 17.4,123.19 C30.2
N$10
  Bottom 0.406: U$15.6 19.89,119.38 16.21,115.7 R26.2 R27.1
N$11  (via drill 0.6)
  Top 0.61: v65.66,11.94 65.02,11.94 v63.37,10.29 63.37,9.14 59.18,4.95 U$6.5
  Bottom 0.61: v65.66,11.94 v65.65,11.93 U$4.1 | v63.37,10.29 63.37,11.68 63.63,11.94
N$13
  Bottom 1.016: R17.2 C28.1
N$14
  Bottom 1.016: 17.91,126.87 C28.2 C29.2
  Bottom 1.27: U$15.5 20.45,124.92 C29.2
N$15
  Bottom 1.27: C27.2 17.78,119.25 19.81,121.28 26.16,121.28 27.25,122.38 U$15.1
N$16
  Top 0.61: R15.2 D1.A
N$17
  Top 0.254: MOT2_HB1.3 25.58,60 25.27,59.69 24.26,59.69 23.62,60.33 23.62,63.5 24.38,64.26 R6.1
  Top 0.406: C34.1 35.22,65.28 32.64,65.28 31.92,64.56 R6.1
N$18
  Top 0.406: MOT2_HB1.1 29.46,61.85 28.74,62.57 C35.2
N$19
  Top 0.406: MOT2_HB1.2 24.98,60.66 C35.1
N$20
  Top 0.254: MOT4_HB1.3 48.46,116.39 47.7,117.15 47.7,120.14 48.34,120.78 53.89,120.78 R7.1 | 54.1,121.28 54.14,121.32
  Top 0.406: C39.1 56.81,121.92 54.74,121.92 54.14,121.32 54.01,121.2 R7.1
N$21
  Top 0.457: MOT4_HB1.1 50.93,119.37 C40.2
N$22
  Top 0.457: MOT4_HB1.2 49.53,117.05 48.46,118.11 48.46,119.29 C40.1
N$23
  Top 0.254: MOT3_HB1.3 36.39,95.32 36.58,95.5 38.68,95.5 39.32,94.87 39.32,93.09 38.94,92.71 34.12,92.71 R8.1
  Top 0.406: C44.1 28.92,89.95 29.34,89.53 31.88,89.53 32.22,89.88 R8.1
N$24
  Top 0.457: C45.2 35.99,94 MOT3_HB1.1
N$25
  Top 0.457: MOT3_HB1.2 37.28,94.66 38.14,93.8 C45.1
N$26
  Top 0.254: R9.1 63.63,72.17 63.63,71.63 64.14,71.12 68.15,71.12 68.66,71.63 68.66,75.18 67.95,75.89 MOT5_HB1.3
  Top 0.406: R9.1 62.57,71.12 59.82,71.12 59.18,71.75 59.18,72.3 C49.1
N$27
  Top 0.305: C50.2 66.24,72.55 66.24,73.88 MOT5_HB1.1
N$28
  Top 0.305: MOT5_HB1.2 67.59,75.23 67.77,75.06 67.77,72.38 C50.1
N$29
  Top 0.254: MOT1_HB1.3 22.88,78.92 21.54,80.26 21.54,83.69 22.05,84.2 25.82,84.2 R10.1
  Top 0.406: R10.1 26.84,83.35 27.69,84.2 29.88,84.2 C54.1
N$30
  Top 0.457: MOT1_HB1.1 24.77,82.79 C55.2
N$31
  Top 0.457: MOT1_HB1.2 23.49,79.58 22.43,80.64 22.43,82.84 C55.1
N$32
  Top 0.61: 65.79,25.15 64.01,25.15 62.48,26.67 62.48,28.32 59.69,31.11 56.64,31.11 56.01,31.75 56.01,38.73 55.45,39.29 J4.1 55.45,41.15 56.21,41.91 56.21,46.23 52.27,50.16 52.27,66.04 51.42,66.89 R15.1 | 65.79,25.15 66.55,25.91 U1.+3V3_2 | C8.2 64.48,23.84 65.79,25.15
N$33  (via drill 0.6)
  Top 1.27: U$16.P$1 12.83,117.47 | 13.46,116.84 U$16.P$1 | U$16.P$1 9.02,114.3 D3.C | 25.98,119.2 U$15.2 25.98,119.63 24.33,121.28 16,121.28 U$16.P$1
  Bottom 1.27: C27.1 13.84,119.12 U$16.P$1
  other vias: 12.19,117.47

## Text on the board
tNames: GripServo | M3 | M4 | M5 | 12VDC / Fan | Grip / Mtr | Enc3 | Enc4 | Enc5 | Missouri S&T / Mars Rover Design Team / Arm Board / 2017 | Gryphon | Rev 3 / Drue Satterfield | Enc1 | Enc2 | He's lumpy, but he has a big heart | Tiva / Pwr Enable | M1 | M2 | Gnd | act | Gnd | logic | extra | power INPUT